# Altium project AMT103 Encoder Interface.PrjPcb
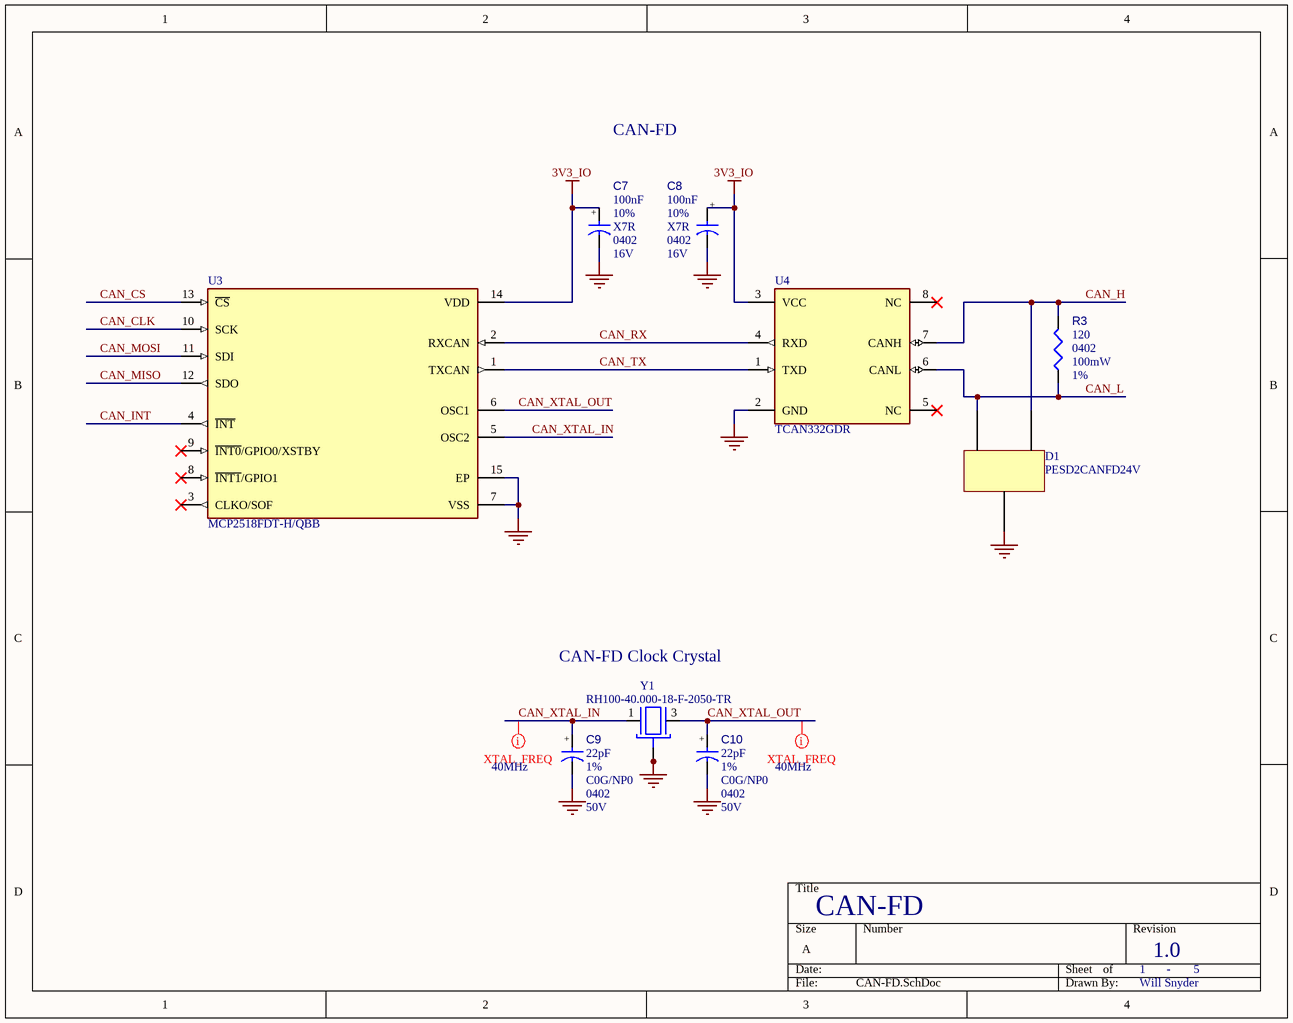
[diagram p0: CAN-FD.SchDoc]
5 sheets, 47 parts. Net scope: global (net labels, ports and power ports of the same name join across sheets).
Board file: AMT103 Encoder Interface.PcbDoc
Sheets:
  CAN-FD.SchDoc
  IO.SchDoc
  MCU.SchDoc
  Power Supplies.SchDoc
  Logic Level Shifting.SchDoc

## Sheet CAN-FD.SchDoc
size A; Engineer: Will Snyder; Revision: 1.0; SheetNumber: 1; SheetTotal: 5; DocumentTitle: CAN-FD

### Parts
C7  value 100nF  Tolerance: 10%  Capacitor Type: X7R  Case/Package: 0402  Voltage Rating: 16V  [CAPC1005X56X25LL10T15]  (hidden comment: Capacitor 0.1 uF +/- 5% 16 V 0402)
C8  value 100nF  Tolerance: 10%  Capacitor Type: X7R  Case/Package: 0402  Voltage Rating: 16V  [CAPC1005X56X25LL10T15]  (hidden comment: Capacitor 0.1 uF +/- 5% 16 V 0402)
C9  value 22pF  Tolerance: 1%  Capacitor Type: C0G/NP0  Case/Package: 0402  Voltage Rating: 50V  [CAPC1005X56X25LL10T15]  (hidden comment: Capacitor 0.1 uF +/- 5% 16 V 0402)
C10  value 22pF  Tolerance: 1%  Capacitor Type: C0G/NP0  Case/Package: 0402  Voltage Rating: 50V  [CAPC1005X56X25LL10T15]  (hidden comment: Capacitor 0.1 uF +/- 5% 16 V 0402)
D1  PESD2CANFD24V  [SOT95P230X110-3N]
R3  value 120  Case/Package: 0402  Power: 100mW  Tolerance: 1%  [FP-ERJ2RK-IPC_B]  (hidden comment: ERJ-2RKF3002X)
U3  MCP2518FDT-H/QBB  [FP-C04-21361-IPC_A]
U4  TCAN332GDR  [Copy of SOIC127P599X175-8N]
Y1  RH100-40.000-18-F-2050-TR  [XTAL_RH100-40.000-18-F-2050-TR]

### Nets
3V3_IO: C7.1 C8.1 U3.14(VDD) U4.3(VCC)
GND: C7.2 C8.2 C9.2 C10.2 D1.3(CC) U3.7(VSS) U3.15(EP) U4.2(GND) Y1.2(GND) Y1.4(GND)
CAN_CLK: U3.10(SCK)
CAN_CS: U3.13(~{CS})
CAN_H: D1.1(K1) R3.1 U4.7(CANH)
CAN_INT: U3.4(~{INT})
CAN_L: D1.2(K2) R3.2 U4.6(CANL)
CAN_MISO: U3.12(SDO)
CAN_MOSI: U3.11(SDI)
CAN_RX: U3.2(RXCAN) U4.4(RXD)
CAN_TX: U3.1(TXCAN) U4.1(TXD)
CAN_XTAL_IN: C9.1 U3.5(OSC2) Y1.1
CAN_XTAL_OUT: C10.1 U3.6(OSC1) Y1.3

Not connected (* = marked no-connect by the designer): U3 3(CLKO/SOF)* 8(~{INT1}/GPIO1)* 9(~{INT0}/GPIO0/XSTBY)*; U4 5(NC)* 8(NC)*

### Layout directives
Frequency: 40MHz: CAN_XTAL_IN, CAN_XTAL_OUT

### Notes on the sheet
- CAN-FD
- CAN-FD Clock Crystal
- -
- (in symbol CMP-001-00001-9) +

### Library data of the parts
C7-C10 = CMP-001-00001-9: Chip Capacitor, 0.1 uF, +/- 5%, 16 V, 0402 (1005 Metric); Mounting Technology: SM; RoHS Compliant: True; Max Operating Temperature: 125°C; Pins: 2; Min Operating Temperature: -55°C
D1 = CMP-004-00043-1: Trans Voltage Suppressor Diode, 24V V(RWM), Bidirectional, 2 Element, Silicon, TO-236AB; RoHS Compliant: Yes
R3 = CMP-009-00190-1: Fixed Resistor, Metal Glaze/thick Film, 0.1W, 30000ohm, 50V, 1% +/-Tol, 100ppm/Cel, Surface Mount, 0402; Min Operating Temperature: -55°C; RoHS Compliant: Yes; Pins: 2; Max Operating Temperature: 155°C; Mounting Technology: Surface Mount
U3 = CMP-015-00016-2: 1 Channel(s), 8MBps, CMOS, PDCC14; RoHS Compliant: Yes
U4 = CMP-015-00013-7: Interface Circuit, PDSO8; Nominal Supply Voltage: 3.3V; Min Operating Temperature: -40°C; Pins: 8; Case/Package: SOP; Max Operating Temperature: 125°C; RoHS Compliant: Yes
Y1 = CMP-003-00030-2: 40 MHz Â±20ppm Crystal 18pF 50 Ohms 4-SMD, No Lead; MF: Raltron Electronics; Pins: 4; SnapEDA_Link: https://www.snapeda.com/parts/RH100-40.000-18-F-2050-TR/Raltron+Electronics/view-part/?ref=snap; Check_prices: https://www.snapeda.com/parts/RH100-40.000-18-F-2050-TR/Raltron+Electronics/view-part/?ref=eda; Case/Package: None; Source: RH100-40.000-18-F-2050-TR.SchLib; Component Type: Standard; Design Item ID: RH100-40.000-18-F-2050-TR; Value: *; MP: RH100-40.000-18-F-2050-TR

## Sheet IO.SchDoc
size A; Engineer: Will Snyder; Revision: 1.0; SheetNumber: 2; SheetTotal: 5; DocumentTitle: I/O
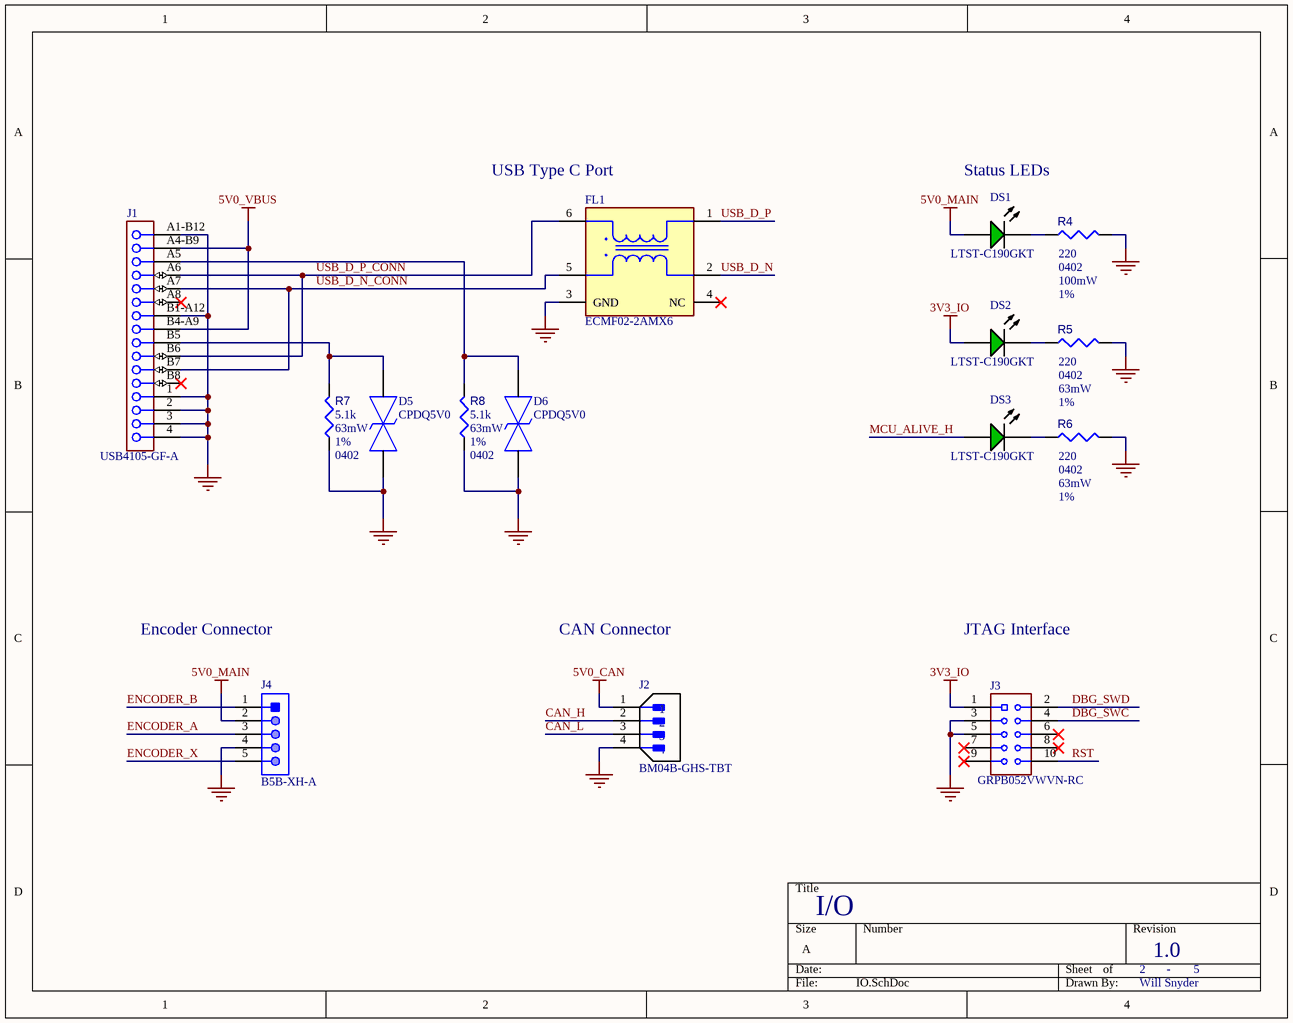
[diagram p1: IO.SchDoc]

### Parts
D5  CPDQ5V0  [MBTB-D-SOD-923F-IMP-0402]
D6  CPDQ5V0  [MBTB-D-SOD-923F-IMP-0402]
DS1  LTST-C190GKT  [LTST-C190GKT_V]
DS2  LTST-C190GKT  [LTST-C190GKT_V]
DS3  LTST-C190GKT  [LTST-C190GKT_V]
FL1  ECMF02-2AMX6  [FP-QFN-6L-IPC_A]
J1  USB4105-GF-A  [FP-USB4105-GF-A-MFG]
J2  BM04B-GHS-TBT  [FP-BM04B-GHS-TBT_LF_SN-MFG]
J3  GRPB052VWVN-RC  [SULLINS_GRPB052VWVN-RC]
J4  B5B-XH-A  [JST_B5B-XH-A]
R4  value 220  Case/Package: 0402  Tolerance: 1%  Power: 100mW  [RESC1005X40X25NL05T05]  (hidden comment: ERJ-2RKF1430X)
R5  value 220  Tolerance: 1%  Power: 63mW  Case/Package: 0402  [RESC1005X40X25NL05T05]  (hidden comment: CRCW040259R0FKED)
R6  value 220  Tolerance: 1%  Power: 63mW  Case/Package: 0402  [RESC1005X40X25NL05T05]  (hidden comment: CRCW040259R0FKED)
R7  value 5.1k  Power: 63mW  Tolerance: 1%  Case/Package: 0402  [RESC1005X40X25NL05T05]  (hidden comment: MCS04020C5101FE000)
R8  value 5.1k  Power: 63mW  Tolerance: 1%  Case/Package: 0402  [RESC1005X40X25NL05T05]  (hidden comment: MCS04020C5101FE000)

### Nets
3V3_IO: DS2.1(A) J3.1
5V0_CAN: J2.1
5V0_MAIN: DS1.1(A) J4.2
5V0_VBUS: J1.A4-B9(VBUS) J1.B4-A9(VBUS)
GND: D5.2(A) D6.2(A) FL1.3(GND) J1.1(MNT_1) J1.2(MNT_2) J1.3(MNT_3) J1.4(MNT_4) J1.A1-B12(GND) J1.B1-A12(GND) J2.4 J3.3 J3.5 J4.4 R4.2 R5.2 R6.2 R7.2 R8.2
CAN_H: J2.2
CAN_L: J2.3
DBG_SWC: J3.4
DBG_SWD: J3.2
ENCODER_A: J4.3
ENCODER_B: J4.1
ENCODER_X: J4.5
MCU_ALIVE_H: DS3.1(A)
RST: J3.10
USB_D_N: FL1.2(D-)
USB_D_N_CONN: FL1.5(D-) J1.A7(Dn1) J1.B7(Dn2)
USB_D_P: FL1.1(D+)
USB_D_P_CONN: FL1.6(D+) J1.A6(Dp1) J1.B6(Dp2)
NetD5_1: D5.1(K) J1.B5(CC2) R7.1
NetD6_1: D6.1(K) J1.A5(CC1) R8.1
NetDS1_2: DS1.2(K) R4.1
NetDS2_2: DS2.2(K) R5.1
NetDS3_2: DS3.2(K) R6.1

Not connected (* = marked no-connect by the designer): FL1 4(NC)*; J1 A8(SBU1)* B8(SBU2)*; J3 6* 7* 8* 9*

### Notes on the sheet
- USB Type C Port
- Status LEDs
- Encoder Connector
- CAN Connector
- JTAG Interface
- -

### Library data of the parts
D5 D6 = CMP-004-00042-2: 18.6V Clamp 9.4A (8/20Âµs) Ipp Tvs Diode Surface Mount 0402/SOD-923F; MF: Comchip Technology; Design Item ID: CPDQ5V0-HF; SnapEDA_Link: https://www.snapeda.com/parts/CPDQ5V0-HF/Comchip%20Technology/view-part/809934/?ref=snap; Component Type: Standard; Purchase-URL: https://pricing.snapeda.com/search/part/CPDQ5V0-HF/?ref=eda; Pins: 2; Availability: Good; Source: CPDQ5V0-HF.SchLib; Case/Package: 0402 Comchip; Price: None; MP: CPDQ5V0-HF; Check_prices: https://www.snapeda.com/parts/CPDQ5V0-HF/Comchip%20Technology/view-part/809934/?ref=eda; Value: *
DS1-DS3 = CMP-007-00022-2: LED Uni-Color Green, 100 mW, 30 mA, -55 to 85 degC, 2-Pin SMD, RoHS, Tape and Reel; Manufacturer: Lite-On; Power: 100mW; Forward Voltage: 2.1V; Viewing Angle: 130degrees; Forward Current: 20mA; Luminous Intensity: 6mcd; Lens Style: Clear; Manufacturer URL: http://www.us.liteon.com/; RoHS Compliant: True; Colour: Green; Package Description: 2-Pin Surface Mount Device, Body 1.6 x 0.8 mm; Datasheet URL: http://datasheet.octopart.com/LTST-C190GKT-Lite-On-datasheet-158530.pdf; Datasheet Version: Dec-06; Mounting Technology: SM; Case/Package: 0603; Package Reference: C190GKT; Packaging: TapeandReel; Min Operating Temperature: -55°C; Nominal Vf: 2.1V; Package Quantity: 3000; Illumination Colour: Green; Max Operating Temperature: 85°C; Pins: 2
FL1 = CMP-00030-00005-1: Data Line Filter, 2 Function(s), 6 Pin(s), Plastic; Mounting Technology: Surface Mount; RoHS Compliant: Yes; Pins: 6; Min Operating Temperature: -40°C; Max Operating Temperature: 85°C
J1 = CMP-002-00095-3: Conn USB 2.0 Type C RCP 24 POS 0.3mm/0.5mm Solder RA SMD 24 Terminal 1 Port T/R
J2 = CMP-002-00096-2: Conn Shrouded Header HDR 4 POS 1.25mm Solder ST Top Entry SMD T/R
J3 = CMP-002-00094-2: Connector Header Through Hole 10 position 0.050 (1.27mm); MF: Sullins; Price: None; Case/Package: None; SnapEDA_Link: https://www.snapeda.com/parts/GRPB052VWVN-RC/Sullins+Connector+Solutions/view-part/?ref=snap; MP: GRPB052VWVN-RC; Design Item ID: GRPB052VWVN-RC; Pins: 10; Value: *; Purchase-URL: https://pricing.snapeda.com/search/part/GRPB052VWVN-RC/?ref=eda; Source: GRPB052VWVN-RC.SchLib; Check_prices: https://www.snapeda.com/parts/GRPB052VWVN-RC/Sullins+Connector+Solutions/view-part/?ref=eda; Component Type: Standard; Availability: In Stock
J4 = CMP-002-00099-1: Connector Header, XH Series, 5 Position, 2.50mm, Through Hole, Press-Fit, Solder, Natural
R4 = CMP-009-00208-1: Fixed Resistor, Metal Glaze/thick Film, 0.1W, 143ohm, 50V, 1% +/-Tol, 100ppm/Cel, Surface Mount, 0402; Mounting Technology: Surface Mount; RoHS Compliant: Yes; Min Operating Temperature: -55°C; Pins: 2; Max Operating Temperature: 155°C
R5 R6 = CMP-009-00207-1: Fixed Resistor, Metal Glaze/thick Film, 0.063W, 59ohm, 50V, 1% +/-Tol, 100ppm/Cel, Surface Mount, 0402; Mounting Technology: Surface Mount; Max Operating Temperature: 155°C; RoHS Compliant: Yes; Min Operating Temperature: -55°C; Pins: 2
R7 R8 = CMP-009-00205-1: Fixed Resistor, Thin Film, 0.063W, 5100ohm, 50V, 1% +/-Tol, 50ppm/Cel, Surface Mount, 0402; Min Operating Temperature: -55°C; Pins: 2; Max Operating Temperature: 125°C; Mounting Technology: Surface Mount; RoHS Compliant: Yes

## Sheet MCU.SchDoc
size A; Engineer: Will Snyder; Revision: 1.0; SheetNumber: 3; SheetTotal: 5; DocumentTitle: MCU
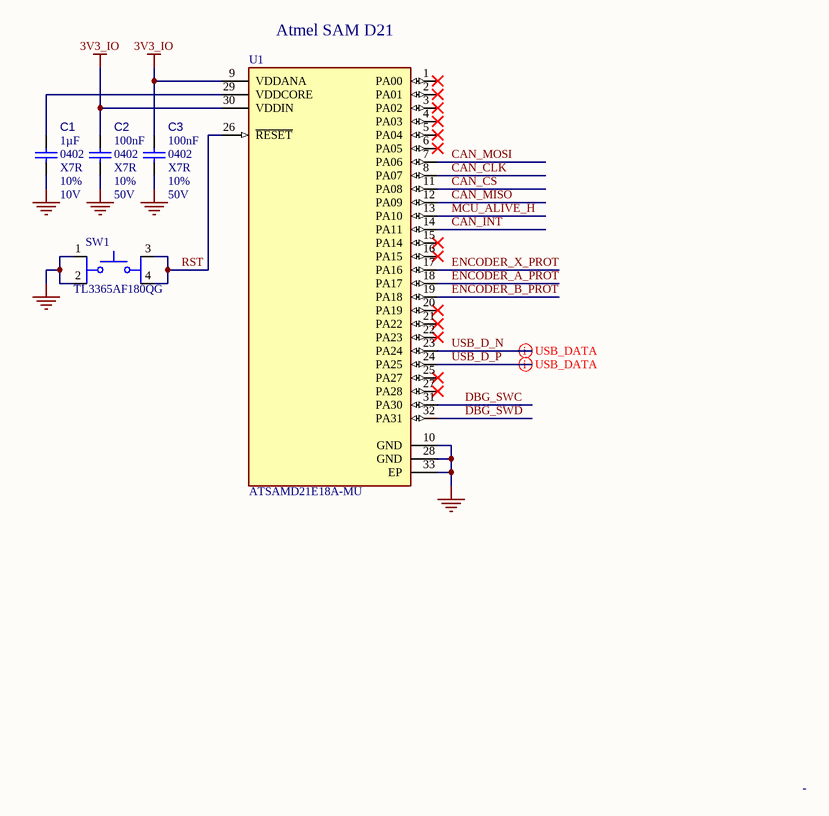
[diagram p2: MCU.SchDoc]

### Parts
C1  value 1µF  Case/Package: 0402  Voltage Rating: 10V  Capacitor Type: X7R  Tolerance: 10%  [CAPC1005X55X30NL05T10]  (hidden comment: GRM155Z71A105KE01D)
C2  value 100nF  Voltage Rating: 50V  Capacitor Type: X7R  Case/Package: 0402  Tolerance: 10%  [CAPC1005X55X30NL05T10]  (hidden comment: 04025C104KAT4A)
C3  value 100nF  Voltage Rating: 50V  Capacitor Type: X7R  Case/Package: 0402  Tolerance: 10%  [CAPC1005X55X30NL05T10]  (hidden comment: 04025C104KAT4A)
SW1  TL3365AF180QG  [SW_TL3365AF180QG]
U1  ATSAMD21E18A-MU  [FP-PG-IPC_A]

### Nets
3V3_IO: C2.1 C3.1 U1.9(VDDANA) U1.30(VDDIN)
GND: C1.2 C2.2 C3.2 SW1.1 SW1.2 U1.10(GND) U1.28(GND) U1.33(EP)
CAN_CLK: U1.8(PA07)
CAN_CS: U1.11(PA08)
CAN_INT: U1.14(PA11)
CAN_MISO: U1.12(PA09)
CAN_MOSI: U1.7(PA06)
DBG_SWC: U1.31(PA30)
DBG_SWD: U1.32(PA31)
ENCODER_A_PROT: U1.18(PA17)
ENCODER_B_PROT: U1.19(PA18)
ENCODER_X_PROT: U1.17(PA16)
MCU_ALIVE_H: U1.13(PA10)
RST: SW1.3 SW1.4 U1.26(~{RESET})
USB_D_N: U1.23(PA24)
USB_D_P: U1.24(PA25)
NetC1_1: C1.1 U1.29(VDDCORE)

Not connected (* = marked no-connect by the designer): U1 1(PA00)* 2(PA01)* 3(PA02)* 4(PA03)* 5(PA04)* 6(PA05)* 15(PA14)* 16(PA15)* 20(PA19)* 21(PA22)* 22(PA23)* 25(PA27)* 27(PA28)*

### Layout directives
differential pair: USB_D_N, USB_D_P

### Notes on the sheet
- (near U1) Atmel SAM D21
- -

### Library data of the parts
C1 = CMP-001-00092-1: Ceramic Capacitor, Multilayer, Ceramic, 10V, 10% +Tol, 10% -Tol, X7R, 15% TC, 1uF, Surface Mount, 0402; Mounting Technology: Surface Mount; Max Operating Temperature: 125°C; Pins: 2; RoHS Compliant: Yes; Min Operating Temperature: -55°C
C2 C3 = CMP-001-00090-1: Ceramic Capacitor, Multilayer, Ceramic, 50V, 10% +Tol, 10% -Tol, X7R, 15% TC, 0.1uF, Surface Mount, 0402; Pins: 2; RoHS Compliant: Yes
SW1 = CMP-011-00019-2: Tactile Switch SPST-NO Top Actuated Surface Mount; MF: E-Switch; MP: TL3365AF180QG; Case/Package: None; Availability: In Stock; SnapEDA_Link: https://www.snapeda.com/parts/TL3365AF180QG/E-Switch/view-part/?ref=snap; Check_prices: https://www.snapeda.com/parts/TL3365AF180QG/E-Switch/view-part/?ref=eda; Value: *; Pins: 4; Price: None; Purchase-URL: https://pricing.snapeda.com/search/part/TL3365AF180QG/?ref=eda; Component Type: Standard; Design Item ID: TL3365AF180QG; Source: TL3365AF180QG.SchLib
U1 = CMP-020-00023-1: RISC Microcontroller, 32-Bit, FLASH, CORTEX-M0 CPU, 48MHz, CMOS; Max Supply Voltage: 3.63V; Clock Frequency: 32MHz; Min Supply Voltage: 1.62V; Nominal Supply Voltage: 3.3V; RoHS Compliant: Yes; Max Operating Temperature: 85°C; Pins: 32; Case/Package: HVQCCN; Min Operating Temperature: -40°C

## Sheet Power Supplies.SchDoc
size A; Engineer: Will Snyder; Revision: 1.0; SheetNumber: 4; SheetTotal: 5; DocumentTitle: Power Supplies
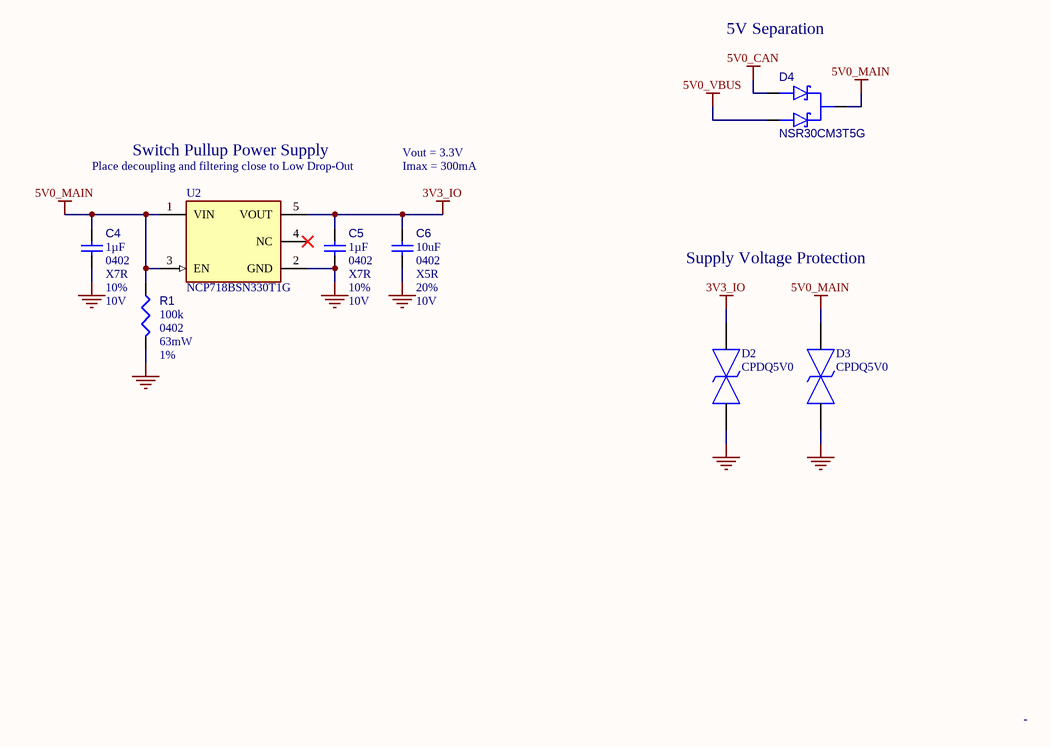
[diagram p3: Power Supplies.SchDoc]

### Parts
C4  value 1µF  Case/Package: 0402  Voltage Rating: 10V  Capacitor Type: X7R  Tolerance: 10%  [CAPC1005X55X30NL05T10]  (hidden comment: GRM155Z71A105KE01D)
C5  value 1µF  Case/Package: 0402  Voltage Rating: 10V  Capacitor Type: X7R  Tolerance: 10%  [CAPC1005X55X30NL05T10]  (hidden comment: GRM155Z71A105KE01D)
C6  value 10uF  Capacitor Type: X5R  Voltage Rating: 10V  Tolerance: 20%  Case/Package: 0402  [CAPC1005X55X30NL05T10]  (hidden comment: GRM155R61A106ME11J)
D2  CPDQ5V0  [MBTB-D-SOD-923F-IMP-0402]
D3  CPDQ5V0  [MBTB-D-SOD-923F-IMP-0402]
D4  NSR30CM3T5G  [ONSC-SOT-723-3-631AA-01_C_V]
R1  value 100k  Power: 63mW  Case/Package: 0402  Tolerance: 1%  [RESC0402(1005)_L]  (hidden comment: 100KR2F)
U2  NCP718BSN330T1G  [SOT95P280X100-5N]

### Nets
3V3_IO: C5.1 C6.1 D2.1(K) U2.5(VOUT)
5V0_CAN: D4.1(A1)
5V0_MAIN: C4.1 D3.1(K) D4.3(K) R1.1 U2.1(VIN) U2.3(EN)
5V0_VBUS: D4.2(A2)
GND: C4.2 C5.2 C6.2 D2.2(A) D3.2(A) R1.2 U2.2(GND)

Not connected (* = marked no-connect by the designer): U2 4(NC)*

### Notes on the sheet
- 5V Separation
- (near U2) Place decoupling and filtering close to Low Drop-Out
- Switch Pullup Power Supply
- Vout = 3.3V
- Imax = 300mA
- Supply Voltage Protection
- -

### Library data of the parts
C4 C5 = CMP-001-00092-1: as C1 on sheet MCU; Mounting Technology: Surface Mount; Max Operating Temperature: 125°C; Pins: 2; RoHS Compliant: Yes; Min Operating Temperature: -55°C
C6 = CMP-001-00091-1: Ceramic Capacitor, Multilayer, Ceramic, 10V, 20% +Tol, 20% -Tol, X5R, 15% TC, 10uF, Surface Mount, 0402
D2 D3 = CMP-004-00042-2: as D5 on sheet IO; Design Item ID: CPDQ5V0-HF; SnapEDA_Link: https://www.snapeda.com/parts/CPDQ5V0-HF/Comchip%20Technology/view-part/809934/?ref=snap; Component Type: Standard; Purchase-URL: https://pricing.snapeda.com/search/part/CPDQ5V0-HF/?ref=eda; Pins: 2; Availability: Good; Source: CPDQ5V0-HF.SchLib; Case/Package: 0402 Comchip; Price: None; MP: CPDQ5V0-HF; Check_prices: https://www.snapeda.com/parts/CPDQ5V0-HF/Comchip%20Technology/view-part/809934/?ref=eda; Value: *
D4 = CMP-004-00026-3: Dual Common Cathode Schottky Barrier Diodes, 3-Pin SOT-723, Pb-Free, Tape and Reel; ComponentLink1Description: Manufacturer URL; ComponentLink1URL: http://www.onsemi.com/; Mounting Technology: SMT; ComponentLink3Description: Package Specification; ComponentLink2URL: http://www.onsemi.cn/pub_link/Collateral/NSR30CM3T5G-D.PDF; ComponentLink3URL: http://www.onsemi.cn/pub_link/Collateral/BAT54M3-D.PDF; Pins: 3; ComponentLink2Description: Datasheet
R1 = CMP-009-00064-2: 100K 0.063W 1% 0402 (1005 Metric)  SMD; Mounting Technology: SMT; Pins: 2
U2 = CMP-019-00058-1: Fixed Positive LDO Regulator, 3.3V, 440V Dropout, PDSO5; RoHS Compliant: Yes

## Sheet Logic Level Shifting.SchDoc
size A; Engineer: Will Snyder; Revision: 1.0; SheetNumber: 5; SheetTotal: 5; DocumentTitle: 5V to 3V3 Logic Level Shifting
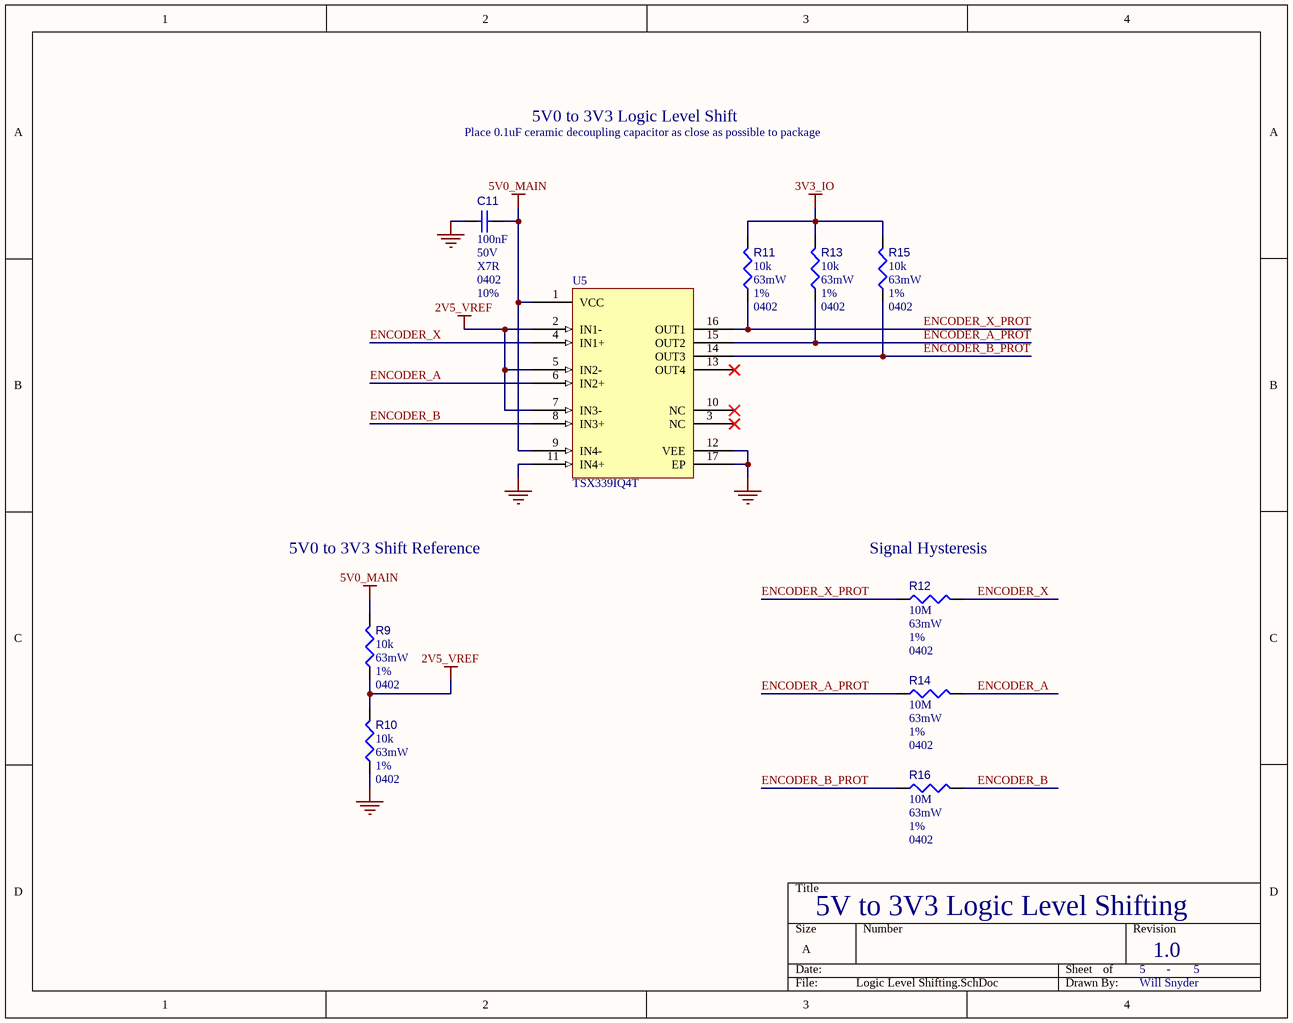
[diagram p4: Logic Level Shifting.SchDoc]

### Parts
C11  value 100nF  Voltage Rating: 50V  Capacitor Type: X7R  Case/Package: 0402  Tolerance: 10%  [CAPC1005X55X30NL05T10]  (hidden comment: 04025C104KAT4A)
R9  value 10k  Power: 63mW  Tolerance: 1%  Case/Package: 0402  [RESC1005X40X25NL05T05]  (hidden comment: MCS04020C5101FE000)
R10  value 10k  Power: 63mW  Tolerance: 1%  Case/Package: 0402  [RESC1005X40X25NL05T05]  (hidden comment: MCS04020C5101FE000)
R11  value 10k  Power: 63mW  Tolerance: 1%  Case/Package: 0402  [RESC1005X40X25NL05T05]  (hidden comment: MCS04020C5101FE000)
R12  value 10M  Power: 63mW  Tolerance: 1%  Case/Package: 0402  [RESC1005X40X25NL05T05]  (hidden comment: MCS04020C5101FE000)
R13  value 10k  Power: 63mW  Tolerance: 1%  Case/Package: 0402  [RESC1005X40X25NL05T05]  (hidden comment: MCS04020C5101FE000)
R14  value 10M  Power: 63mW  Tolerance: 1%  Case/Package: 0402  [RESC1005X40X25NL05T05]  (hidden comment: MCS04020C5101FE000)
R15  value 10k  Power: 63mW  Tolerance: 1%  Case/Package: 0402  [RESC1005X40X25NL05T05]  (hidden comment: MCS04020C5101FE000)
R16  value 10M  Power: 63mW  Tolerance: 1%  Case/Package: 0402  [RESC1005X40X25NL05T05]  (hidden comment: MCS04020C5101FE000)
U5  TSX339IQ4T  [QFN50P300X300X100-16N]

### Nets
2V5_VREF: R9.2 R10.1 U5.2(IN1-) U5.5(IN2-) U5.7(IN3-)
3V3_IO: R11.1 R13.1 R15.1
5V0_MAIN: C11.1 R9.1 U5.1(VCC) U5.9(IN4-)
GND: C11.2 R10.2 U5.11(IN4+) U5.12(VEE) U5.17(EP)
ENCODER_A: R14.1 U5.6(IN2+)
ENCODER_A_PROT: R13.2 R14.2 U5.15(OUT2)
ENCODER_B: R16.1 U5.8(IN3+)
ENCODER_B_PROT: R15.2 R16.2 U5.14(OUT3)
ENCODER_X: R12.1 U5.4(IN1+)
ENCODER_X_PROT: R11.2 R12.2 U5.16(OUT1)

Not connected (* = marked no-connect by the designer): U5 3(NC)* 10(NC)* 13(OUT4)*

### Notes on the sheet
- Place 0.1uF ceramic decoupling capacitor as close as possible to package
- 5V0 to 3V3 Logic Level Shift
- 5V0 to 3V3 Shift Reference
- (near R12) Signal Hysteresis
- -

### Library data of the parts
C11 = CMP-001-00090-1: as C2 on sheet MCU; Pins: 2; RoHS Compliant: Yes
R9-R16 = CMP-009-00205-1: as R7 on sheet IO; Min Operating Temperature: -55°C; Pins: 2; Max Operating Temperature: 125°C; Mounting Technology: Surface Mount; RoHS Compliant: Yes
U5 = CMP-016-00012-1: Comparator, 4 Func, 6000uV Offset-Max, 2500ns Response Time, CMOS; Nominal Supply Voltage: 3V; Min Operating Temperature: -40°C; RoHS Compliant: Yes; Max Operating Temperature: 125°C; Pins: 16; Case/Package: HVQCCN

## Nets that join several sheets
3V3_IO: CAN-FD (C7.1 C8.1 U3.14 U4.3), IO (DS2.1 J3.1), MCU (C2.1 C3.1 U1.9 U1.30), Power Supplies (C5.1 C6.1 D2.1 U2.5), Logic Level Shifting (R11.1 R13.1 R15.1)
5V0_CAN: IO (J2.1), Power Supplies (D4.1)
5V0_MAIN: IO (DS1.1 J4.2), Power Supplies (6 pins), Logic Level Shifting (C11.1 R9.1 U5.1 U5.9)
5V0_VBUS: IO (J1.A4-B9 J1.B4-A9), Power Supplies (D4.2)
GND: CAN-FD (10 pins), IO (18 pins), MCU (8 pins), Power Supplies (7 pins), Logic Level Shifting (5 pins)
CAN_CLK: CAN-FD (U3.10), MCU (U1.8)
CAN_CS: CAN-FD (U3.13), MCU (U1.11)
CAN_H: CAN-FD (D1.1 R3.1 U4.7), IO (J2.2)
CAN_INT: CAN-FD (U3.4), MCU (U1.14)
CAN_L: CAN-FD (D1.2 R3.2 U4.6), IO (J2.3)
CAN_MISO: CAN-FD (U3.12), MCU (U1.12)
CAN_MOSI: CAN-FD (U3.11), MCU (U1.7)
DBG_SWC: IO (J3.4), MCU (U1.31)
DBG_SWD: IO (J3.2), MCU (U1.32)
ENCODER_A: IO (J4.3), Logic Level Shifting (R14.1 U5.6)
ENCODER_A_PROT: MCU (U1.18), Logic Level Shifting (R13.2 R14.2 U5.15)
ENCODER_B: IO (J4.1), Logic Level Shifting (R16.1 U5.8)
ENCODER_B_PROT: MCU (U1.19), Logic Level Shifting (R15.2 R16.2 U5.14)
ENCODER_X: IO (J4.5), Logic Level Shifting (R12.1 U5.4)
ENCODER_X_PROT: MCU (U1.17), Logic Level Shifting (R11.2 R12.2 U5.16)
MCU_ALIVE_H: IO (DS3.1), MCU (U1.13)
RST: IO (J3.10), MCU (SW1.3 SW1.4 U1.26)
USB_D_N: IO (FL1.2), MCU (U1.23)
USB_D_P: IO (FL1.1), MCU (U1.24)